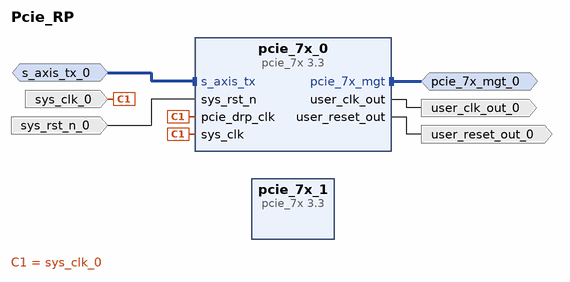
[diagram p0: block diagram of the top level]
# Vivado block design Pcie_RP, xc7a50tcsg325-2L, Vivado 2019.2
create_bd_design Pcie_RP

create_bd_intf_port -mode Master -vlnv xilinx.com:interface:pcie_7x_mgt_rtl:1.0 pcie_7x_mgt_0
create_bd_intf_port -mode Slave -vlnv xilinx.com:interface:axis_rtl:1.0 s_axis_tx_0
set_property -dict [list \
  CONFIG.TDATA_NUM_BYTES 8 \
  CONFIG.TDEST_WIDTH 0 \
  CONFIG.TID_WIDTH 0 \
  CONFIG.TUSER_WIDTH 4 \
  CONFIG.HAS_TREADY 1 \
  CONFIG.HAS_TSTRB 0 \
  CONFIG.HAS_TKEEP 1 \
  CONFIG.HAS_TLAST 1 \
  CONFIG.FREQ_HZ 62500000 \
  CONFIG.LAYERED_METADATA undef \
] [get_bd_intf_ports s_axis_tx_0]
create_bd_port -dir I -type clk sys_clk_0
create_bd_port -dir I -type rst sys_rst_n_0
create_bd_port -dir O -type clk user_clk_out_0
set_property -dict {CONFIG.FREQ_HZ 62500000} [get_bd_ports user_clk_out_0]
create_bd_port -dir O -type rst user_reset_out_0

create_bd_cell -type ip -vlnv xilinx.com:ip:pcie_7x:3.3 pcie_7x_0
set_property -dict [list \
  CONFIG.Acceptable_L1_Latency Maximum_of_1_us \
  CONFIG.Bar0_Scale Megabytes \
  CONFIG.Bar0_Size 1 \
  CONFIG.Bar0_Type Memory \
  CONFIG.Bar1_Type N/A \
  CONFIG.Bar2_Type N/A \
  CONFIG.Bar3_Type N/A \
  CONFIG.Bar4_Type N/A \
  CONFIG.Bar5_Type N/A \
  CONFIG.Base_Class_Menu Bridge_device \
  CONFIG.Class_Code_Base 06 \
  CONFIG.Class_Code_Sub 00 \
  CONFIG.Device_ID 7111 \
  CONFIG.Device_Port_Type Root_Port_of_PCI_Express_Root_Complex \
  CONFIG.Link_Speed 2.5_GT/s \
  CONFIG.Pcie_fast_config None \
  CONFIG.Sub_Class_Interface_Menu Host_bridge \
  CONFIG.en_ext_clk false \
  CONFIG.mode_selection Advanced \
  CONFIG.pipe_mode_sim None \
] [get_bd_cells pcie_7x_0]
create_bd_cell -type ip -vlnv xilinx.com:ip:pcie_7x:3.3 pcie_7x_1
set_property -dict [list \
  CONFIG.Acceptable_L1_Latency Maximum_of_1_us \
  CONFIG.Bar0_Scale Megabytes \
  CONFIG.Bar0_Size 1 \
  CONFIG.Bar0_Type Memory \
  CONFIG.Bar1_Type N/A \
  CONFIG.Bar2_Type N/A \
  CONFIG.Bar3_Type N/A \
  CONFIG.Bar4_Type N/A \
  CONFIG.Bar5_Type N/A \
  CONFIG.Base_Class_Menu Bridge_device \
  CONFIG.Class_Code_Base 06 \
  CONFIG.Class_Code_Sub 00 \
  CONFIG.Device_ID 7111 \
  CONFIG.Device_Port_Type Root_Port_of_PCI_Express_Root_Complex \
  CONFIG.Link_Speed 2.5_GT/s \
  CONFIG.Pcie_fast_config None \
  CONFIG.Sub_Class_Interface_Menu Host_bridge \
  CONFIG.en_ext_clk false \
  CONFIG.mode_selection Advanced \
  CONFIG.pipe_mode_sim None \
] [get_bd_cells pcie_7x_1]

# ---- connections ----

connect_bd_intf_net [get_bd_intf_ports pcie_7x_mgt_0] [get_bd_intf_pins pcie_7x_0/pcie_7x_mgt]
connect_bd_intf_net -intf_net s_axis_tx_0_1 [get_bd_intf_ports s_axis_tx_0] [get_bd_intf_pins pcie_7x_0/s_axis_tx]
connect_bd_net -net sys_clk_0_1 [get_bd_ports sys_clk_0] [get_bd_pins pcie_7x_0/sys_clk] [get_bd_pins pcie_7x_0/pcie_drp_clk]
connect_bd_net -net sys_rst_n_0_1 [get_bd_ports sys_rst_n_0] [get_bd_pins pcie_7x_0/sys_rst_n]
connect_bd_net [get_bd_pins pcie_7x_0/user_clk_out] [get_bd_ports user_clk_out_0]
connect_bd_net [get_bd_pins pcie_7x_0/user_reset_out] [get_bd_ports user_reset_out_0]

validate_bd_design
save_bd_design
